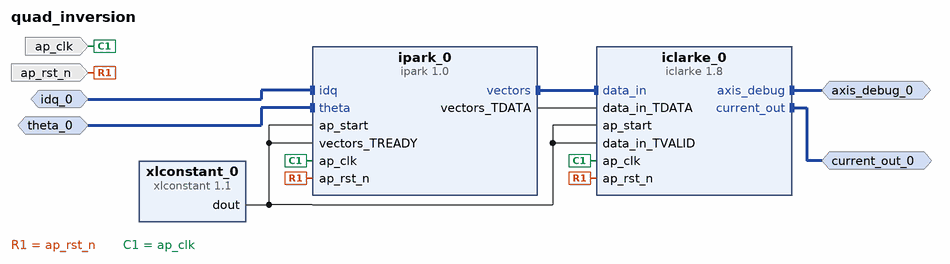
[diagram p0: block diagram of the top level]
# Vivado block design quad_inversion, xc7z020clg400-1, Vivado 2021.2
create_bd_design quad_inversion

create_bd_intf_port -mode Slave -vlnv xilinx.com:interface:axis_rtl:1.0 idq_0
set_property -dict [list \
  CONFIG.HAS_TKEEP 0 \
  CONFIG.HAS_TLAST 0 \
  CONFIG.HAS_TREADY 1 \
  CONFIG.HAS_TSTRB 0 \
  CONFIG.LAYERED_METADATA undef \
  CONFIG.TDATA_NUM_BYTES 8 \
  CONFIG.TDEST_WIDTH 0 \
  CONFIG.TID_WIDTH 0 \
  CONFIG.TUSER_WIDTH 0 \
] [get_bd_intf_ports idq_0]
create_bd_intf_port -mode Slave -vlnv xilinx.com:interface:axis_rtl:1.0 theta_0
set_property -dict [list \
  CONFIG.HAS_TKEEP 0 \
  CONFIG.HAS_TLAST 0 \
  CONFIG.HAS_TREADY 1 \
  CONFIG.HAS_TSTRB 0 \
  CONFIG.LAYERED_METADATA undef \
  CONFIG.TDATA_NUM_BYTES 2 \
  CONFIG.TDEST_WIDTH 0 \
  CONFIG.TID_WIDTH 0 \
  CONFIG.TUSER_WIDTH 0 \
] [get_bd_intf_ports theta_0]
create_bd_intf_port -mode Master -vlnv xilinx.com:interface:axis_rtl:1.0 current_out_0
create_bd_intf_port -mode Master -vlnv xilinx.com:interface:axis_rtl:1.0 axis_debug_0
create_bd_port -dir I -type clk ap_clk
set_property -dict {CONFIG.FREQ_HZ 100000000} [get_bd_ports ap_clk]
create_bd_port -dir I -type rst ap_rst_n

create_bd_cell -type ip -vlnv xilinx.com:hls:ipark:1.0 ipark_0
create_bd_cell -type ip -vlnv xilinx.com:ip:xlconstant:1.1 xlconstant_0
set_property -dict {CONFIG.CONST_VAL 1} [get_bd_cells xlconstant_0]
create_bd_cell -type ip -vlnv xilinx.com:hls:iclarke:1.8 iclarke_0

# ---- connections ----

connect_bd_intf_net [get_bd_intf_ports axis_debug_0] [get_bd_intf_pins iclarke_0/axis_debug]
connect_bd_intf_net [get_bd_intf_ports current_out_0] [get_bd_intf_pins iclarke_0/current_out]
connect_bd_intf_net -intf_net idq_0_1 [get_bd_intf_ports idq_0] [get_bd_intf_pins ipark_0/idq]
connect_bd_intf_net [get_bd_intf_pins iclarke_0/data_in] [get_bd_intf_pins ipark_0/vectors]
connect_bd_intf_net -intf_net theta_0_1 [get_bd_intf_ports theta_0] [get_bd_intf_pins ipark_0/theta]
connect_bd_net [get_bd_ports ap_rst_n] [get_bd_pins ipark_0/ap_rst_n] [get_bd_pins iclarke_0/ap_rst_n]
connect_bd_net [get_bd_ports ap_clk] [get_bd_pins ipark_0/ap_clk] [get_bd_pins iclarke_0/ap_clk]
connect_bd_net [get_bd_pins ipark_0/vectors_TDATA] [get_bd_pins iclarke_0/data_in_TDATA]
connect_bd_net [get_bd_pins xlconstant_0/dout] \
  [get_bd_pins ipark_0/ap_start] [get_bd_pins ipark_0/vectors_TREADY] [get_bd_pins iclarke_0/ap_start] \
  [get_bd_pins iclarke_0/data_in_TVALID]

validate_bd_design
save_bd_design
